# EAGLE design Driver Motor opto bawah (EAGLE 9.5.0)
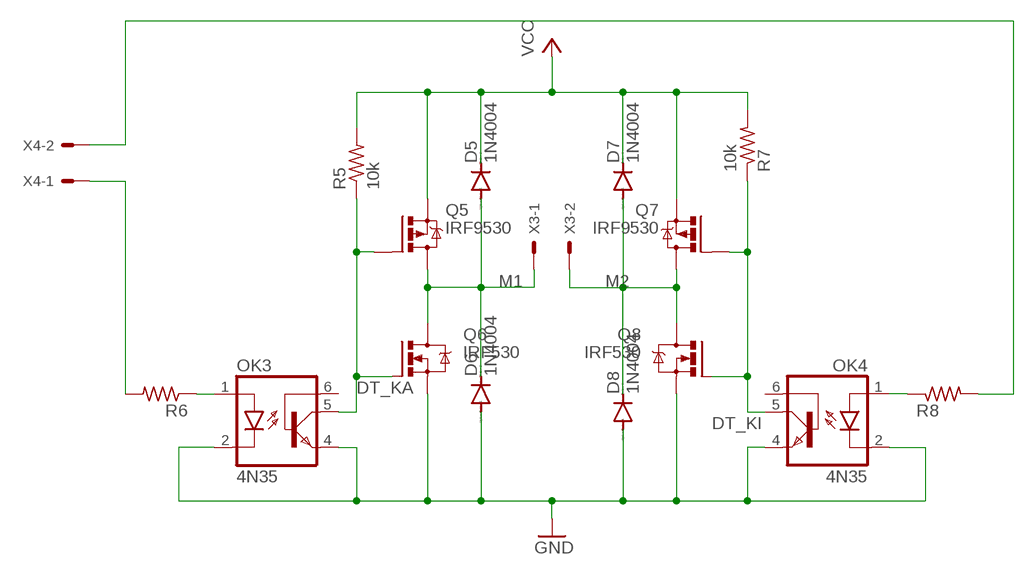
[diagram p0: schematic, sheet 1]

## Parts
D5  1N4004  [DO41-10]
D6  1N4004  [DO41-10]
D7  1N4004  [DO41-10]
D8  1N4004  [DO41-10]
OK3  4N35  [DIL06]
OK4  4N35  [DIL06]
Q5  IRF9530  [TO220BV]
Q6  IRF530  [TO220BV]
Q7  IRF9530  [TO220BV]
Q8  IRF530  [TO220BV]
R5  10k  R-US_0207/10  [0207/10]
R6  R-US_0207/10  [0207/10]
R7  10k  R-US_0207/10  [0207/10]
R8  R-US_0207/10  [0207/10]
X3  22-23-2021  [22-23-2021]
X4  22-23-2021  [22-23-2021]

## Nets
DT_KA: OK3.5(COL) Q5.G Q6.G R5.1
DT_KI: OK4.5(COL) Q7.G Q8.G R7.1
GND: D6.A D8.A OK3.2(C) OK3.4(EMI) OK4.2(C) OK4.4(EMI) Q6.S Q8.S
M1: D5.A D6.C Q5.D Q6.D X3.1
M2: D7.A D8.C Q7.D Q8.D X3.2
N$9: OK4.1(A) R8.1
N$11: OK3.1(A) R6.1
N$12: R6.2 X4.1
N$15: R8.2 X4.2
VCC: D5.C D7.C Q5.S Q7.S R5.2 R7.2
Unconnected: OK3.6(BAS) OK4.6(BAS)

## Library data of the parts
D5-D8 = diode:1N4004: DIODE general purpose rectifier, 1 A
OK3 OK4 = optocoupler:4N35: MOTOROLA OPTO COUPLER; MF: FAIRCHILD SEMICONDUCTOR; MPN: 4N35; OC_FARNELL: 1328375; OC_NEWARK: 72K9946
Q5 Q7 = transistor-power:IRF9530: P-CHANNEL HEXFET POWER-MOS-FET Source: http://www.irf.com/product-info/datasheets/data/irf9530.pdf
Q6 Q8 = transistor-power:IRF530: HEXFET Power MOSFET
R5-R8 = rcl:R-US_: RESISTOR, American symbol; SPICEPREFIX: R
X3 X4 = con-molex:22-23-2021: .100" (2.54mm) Center Header - 2 Pin; MF: MOLEX; MPN: 22-23-2021; OC_FARNELL: 1462926; OC_NEWARK: 25C3832

## Board
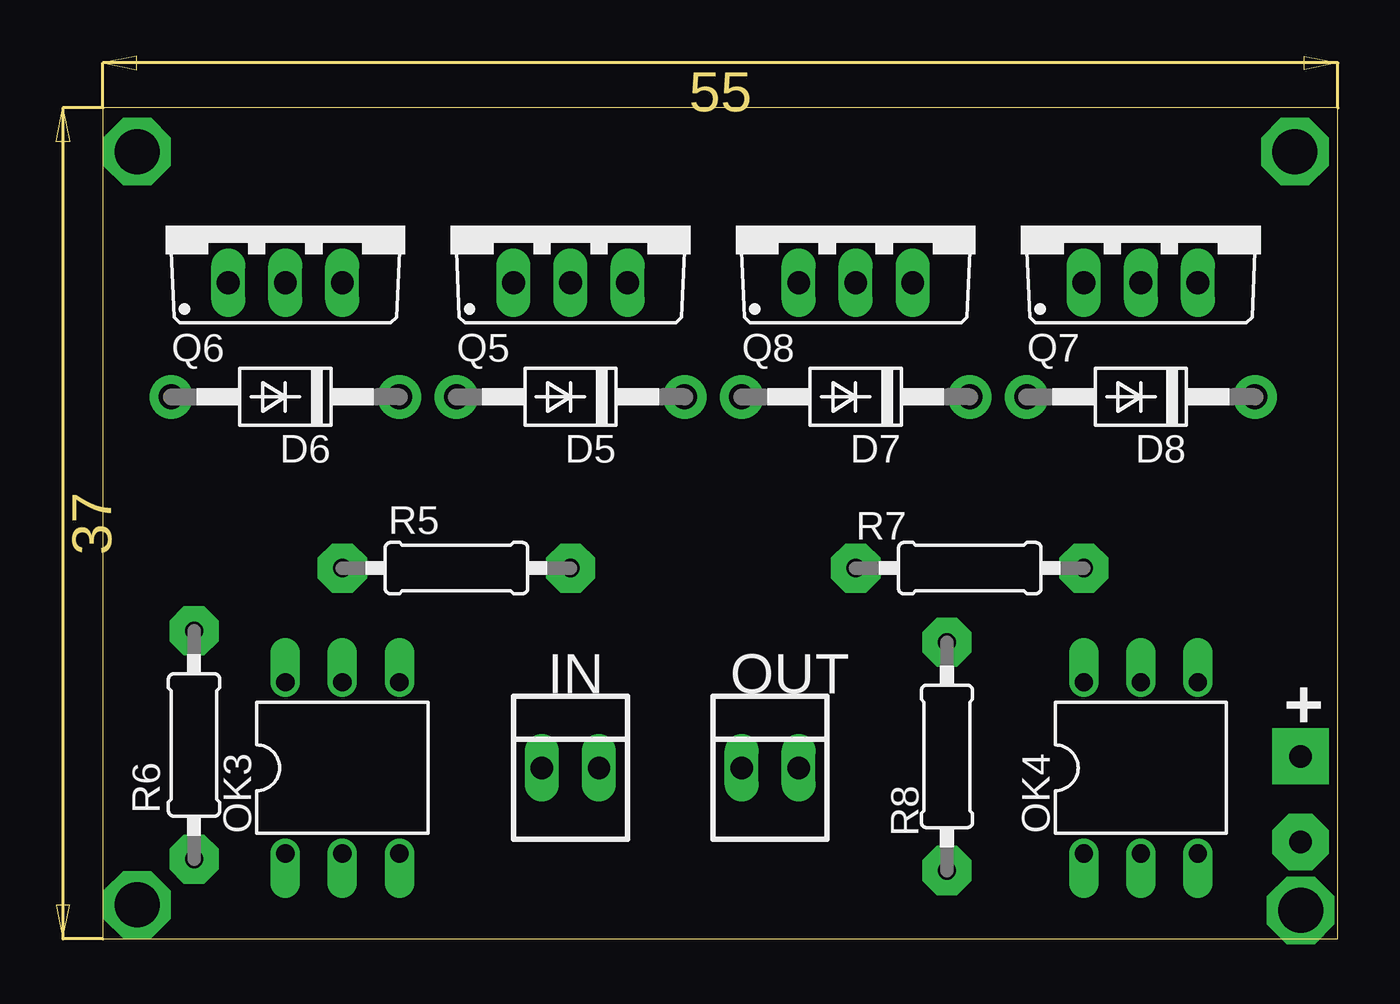
[diagram p1: board, top side]
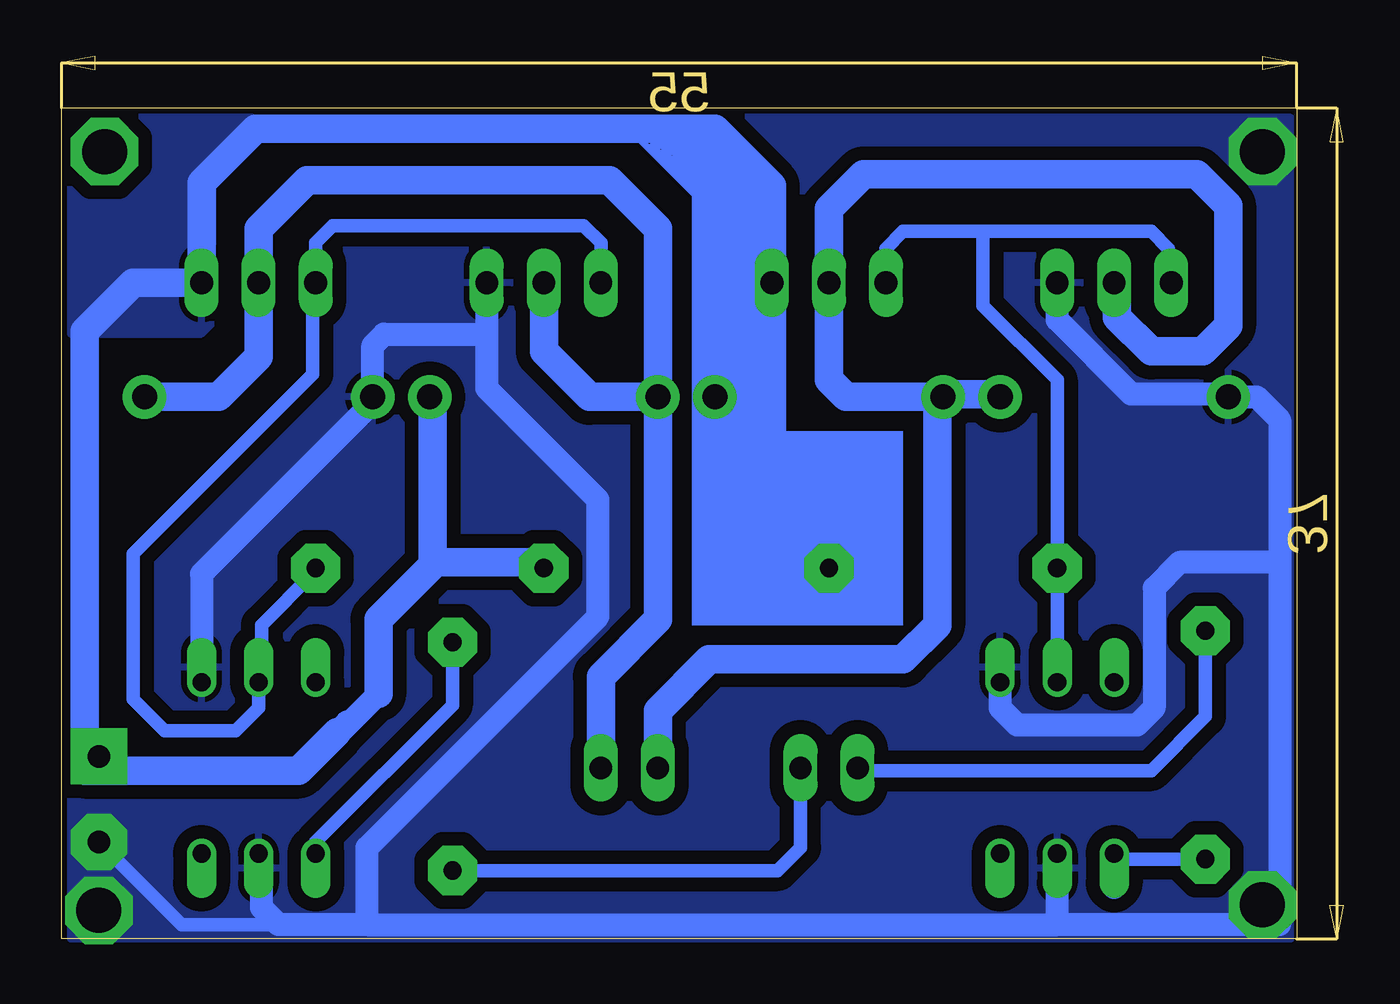
[diagram p2: board, bottom side, seen from below]

Size 55 x 37 mm. Coordinates in mm from the lower left corner, seen from the top.
Outline: 0,0 55,0 55,37 0,37 0,0
Copper layers (1*16): Top 0.035mm / dielectric 1.5mm / Bottom 0.035mm
Design rules "default *": minimum track width 6mil, minimum drill 0.35mm, track to track 24mil, track to pad 24mil, pad to pad 24mil, via to via 24mil, smd to smd 24mil, copper to edge 0mil, drill to drill 6mil, minimum pad ring 10mil, minimum via ring 8mil, stop-mask expansion 4mil, vias tented up to drill 0mil, thermal gap 10mil

### Footprints (pad centres in the part's own frame; a part is rotated, then mirrored left to right if it is on the bottom)
DO41-10 = drill 1.118 pad 1.93: A 5.08,0; C -5.08,0
DIL06 = drill 0.813 offset: 1 -2.54,-3.81; 2 0,-3.81; 3 2.54,-3.81; 4 2.54,3.81; 5 0,3.81; 6 -2.54,3.81
TO220BV = drill 1.016 long: D 0,-2.54; G -2.54,-2.54; S 2.54,-2.54
0207/10 = drill 0.813 pad 2.184 octagon: 1 -5.08,0; 2 5.08,0
22-23-2021 = drill 1 long: 1 -1.27,0; 2 1.27,0

### Placement (x,y rotation side)
D5  20.83,24.13 180 top
D6  8.13,24.13 180 top
D7  33.53,24.13 180 top
D8  46.23,24.13 180 top
OK3  10.67,7.62 0 top
OK4  46.23,7.62 0 top
Q5  20.83,31.75 0 top
Q6  8.13,31.75 0 top
Q7  46.23,31.75 0 top
Q8  33.53,31.75 0 top
R5  15.75,16.51 0 top
R6  4.06,8.64 90 top
R7  38.61,16.51 180 top
R8  37.59,8.13 270 top
X3  29.72,7.62 0 top
X4  20.83,7.62 0 top

### Tracks (layer width: path | path; a pad name or v marks a point on that pad's centre or on a via)
DT_KA
  Bottom 0.61: OK3.5 R5.1 10.67,24.89 13.97,28.19 13.97,31.5 | 13.97,31.5 17.53,31.5 18.29,30.73 Q5.G | 13.97,31.5 6.48,31.5 5.71,30.73 5.71,29.21 Q6.G
DT_KI
  Bottom 0.61: 46.1,11.68 46.1,13.97 43.81,16.26 | Q8.G 30.99,30.99 31.75,31.75 42.93,31.75 43.69,30.99 Q7.G 43.81,29.21 43.81,25.15 51.82,17.14 51.82,10.67 50.42,9.27 47.24,9.27 46.23,10.29 OK4.5
  Bottom 1.016: 46.1,11.68 OK4.5 | 43.81,16.26 R7.1
GND  (via drill 1 pad 2.5, 2 pad 2.1)
  Bottom 0.61: 45.34,0.64 49.66,0.64 v53.34,4.32
  Bottom 1.016: OK4.4 48.77,16.26 41.15,23.88 D8.A | 41.15,24.26 D8.A | 10.67,0.64 OK3.2 10.67,3.68 | 10.67,0.64 0.76,0.64 0.76,16.76 | 0.76,16.76 0.76,23.11 1.78,24.13 D6.A 3.05,24.26 7.37,24.26 10.67,27.56 Q6.S | OK3.4 13.21,10.29 12.45,9.53 7.11,9.53 6.35,10.29 6.35,15.62 5.21,16.76 0.76,16.76 | 41.4,0.64 45.34,0.64 46.1,1.4 46.1,3.68 OK4.2 | 41.4,0.64 41.4,4.06 31.11,14.35 31.11,19.56 36.07,24.51 36.07,26.92 | 41.4,0.64 10.67,0.64 | Q8.S 36.07,26.92 | D8.A 41.15,26.42 40.64,26.92 36.07,26.92
  other vias: 1.52,35.05 1.52,1.52 53.34,1.27
  pour Bottom (isolate 0.406): 0.25,0 0.25,36.58 54.61,36.58 54.61,0
M1
  Bottom 1.016: 8,29.21 Q6.D | 13.34,24.26 D6.C | 15.62,24.26 D5.A 16,23.88
  Bottom 1.27: 8,29.21 8,27.69 6.48,26.16 4.19,26.16 3.05,27.3 3.05,32.64 4.45,34.04 19.3,34.04 20.83,32.51 Q5.D 20.83,24.89 20.07,24.13 D5.A | 15.62,24.26 13.34,24.26 | 16,23.88 16,13.97 17.53,12.45 26.16,12.45 28.45,10.16 X3.1
M2
  Bottom 1.27: D7.A 28.45,14.22 30.99,11.68 X3.2 | D7.A 28.45,31.62 30.61,33.78 44.07,33.78 46.23,31.62 Q7.D 46.23,25.91 48.01,24.13 D8.C | D7.A 31.5,24.13 33.53,26.16 Q8.D
N$1
  Bottom 0.305: 29.21,35.56 26.92,33.27 | 26.67,33.02 26.92,33.27 | 26.92,33.27 26.92,35.31 28.7,35.31 27.18,33.78 27.18,35.05 28.19,35.05 27.43,34.29 27.43,34.8 27.69,34.8
N$3  (via drill 2 pad 2.1)
  other vias: 53.09,35.05
N$9
  Bottom 0.61: OK4.1 43.69,4.32 37.59,10.41 R8.1
N$11
  Bottom 0.61: R6.1 8.13,3.56
  Bottom 1.016: 8.13,2.29 8.13,3.56 OK3.1
N$12
  Bottom 0.61: R6.2 4.06,9.91 6.48,7.49 19.43,7.49
  Bottom 1.016: X4.1 19.43,7.49
N$15
  Bottom 0.61: R8.2 23.11,3.05 22.1,4.06 X4.2
VCC  (via drill 1 pad 2.5)
  Bottom 1.016: D7.C 38.48,23.88 | 33.53,16.64 R7.2 33.78,16.76 | 25.91,24.26 D5.C | 25.91,23.88 D5.C | 42.29,9.65 42.74,9.21 42.61,9.21 40.89,10.92 | D5.C 23.37,24.13 | 38.48,16.76 38.48,16.64
  Bottom 1.27: 42.74,9.21 44.45,7.49 53.59,7.49 | 53.59,7.49 53.98,7.49 v53.34,8.13 | 53.59,7.49 53.98,7.87 53.98,27.05 51.82,29.21 Q7.S 48.77,33.66 46.35,36.07 25.91,36.07 23.37,33.53 Q5.S 23.37,24.13 23.37,19.05 R5.2 | 40.89,10.92 40.89,14.22 38.48,16.64 | 38.48,23.88 38.48,16.76 33.78,16.76
  pour Bottom (isolate 0.406): 54.36,26.92 48.77,26.92 48.26,27.43 48.26,33.53 46.48,35.31 46.48,36.32 46.48,36.58 54.61,36.58 54.61,26.92
(copper drawn outside any net)
  shapes: Bottom area x3

### Text on the board
tPlace: IN | OUT | +